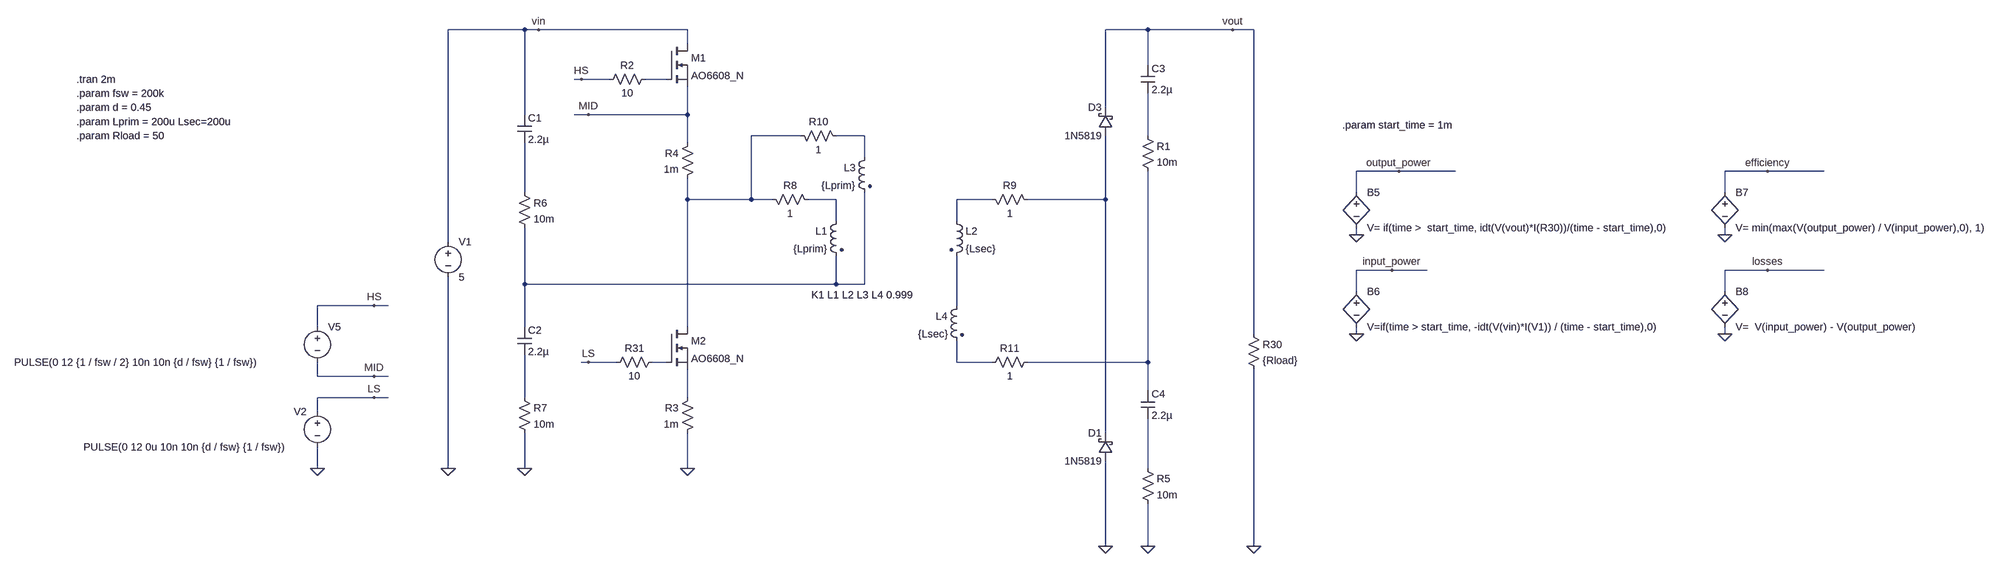
[diagram p0: schematic isolated_supply_v1.asc]
isolated_supply_v1.asc, the LTspice schematic file:
Version 4
SHEET 1 11460 3748
WIRE 656 272 480 272
WIRE 688 272 656 272
WIRE 1024 272 688 272
WIRE 2064 272 1968 272
WIRE 2320 272 2064 272
WIRE 2368 272 2320 272
WIRE 1024 304 1024 272
WIRE 2064 352 2064 272
WIRE 784 384 768 384
WIRE 848 384 784 384
WIRE 976 384 928 384
WIRE 1968 448 1968 272
WIRE 656 464 656 272
WIRE 800 464 768 464
WIRE 1024 464 1024 400
WIRE 1024 464 800 464
WIRE 1280 512 1168 512
WIRE 1424 512 1360 512
WIRE 2064 512 2064 416
WIRE 1024 528 1024 464
WIRE 1424 560 1424 512
WIRE 2736 592 2640 592
WIRE 2864 592 2736 592
WIRE 3680 592 3584 592
WIRE 3808 592 3680 592
WIRE 656 640 656 528
WIRE 2640 640 2640 592
WIRE 3584 640 3584 592
WIRE 1024 656 1024 608
WIRE 1168 656 1168 512
WIRE 1168 656 1024 656
WIRE 1216 656 1168 656
WIRE 1360 656 1296 656
WIRE 1712 656 1632 656
WIRE 1968 656 1968 512
WIRE 1968 656 1792 656
WIRE 1360 704 1360 656
WIRE 1632 704 1632 656
WIRE 2640 736 2640 720
WIRE 3584 736 3584 720
WIRE 480 752 480 272
WIRE 2720 816 2640 816
WIRE 2800 816 2720 816
WIRE 3680 816 3584 816
WIRE 3808 816 3680 816
WIRE 656 848 656 720
WIRE 1360 848 1360 784
WIRE 1360 848 656 848
WIRE 1424 848 1424 640
WIRE 1424 848 1360 848
WIRE 2640 864 2640 816
WIRE 3584 864 3584 816
WIRE 256 896 128 896
WIRE 288 896 256 896
WIRE 1632 896 1632 784
WIRE 128 944 128 896
WIRE 656 944 656 848
WIRE 1024 944 1024 656
WIRE 2368 960 2368 272
WIRE 2640 960 2640 944
WIRE 3584 960 3584 944
WIRE 800 1024 784 1024
WIRE 864 1024 800 1024
WIRE 976 1024 944 1024
WIRE 1632 1024 1632 976
WIRE 1712 1024 1632 1024
WIRE 2064 1024 2064 592
WIRE 2064 1024 1792 1024
WIRE 128 1056 128 1024
WIRE 256 1056 128 1056
WIRE 288 1056 256 1056
WIRE 2064 1088 2064 1024
WIRE 256 1104 128 1104
WIRE 288 1104 256 1104
WIRE 656 1104 656 1008
WIRE 1024 1104 1024 1040
WIRE 128 1136 128 1104
WIRE 1968 1184 1968 656
WIRE 128 1264 128 1216
WIRE 480 1264 480 832
WIRE 656 1264 656 1184
WIRE 1024 1264 1024 1184
WIRE 2064 1264 2064 1152
WIRE 1968 1440 1968 1248
WIRE 2064 1440 2064 1344
WIRE 2368 1440 2368 1040
FLAG 128 1264 0
FLAG 1968 1440 0
FLAG 1024 1264 0
FLAG 480 1264 0
FLAG 800 1024 LS
FLAG 256 1104 LS
FLAG 656 1264 0
FLAG 688 272 vin
FLAG 2320 272 vout
FLAG 2640 736 0
FLAG 2640 960 0
FLAG 2736 592 output_power
FLAG 2720 816 input_power
FLAG 3584 736 0
FLAG 3680 592 efficiency
FLAG 3584 960 0
FLAG 3680 816 losses
FLAG 800 464 MID
FLAG 784 384 HS
FLAG 256 1056 MID
FLAG 256 896 HS
FLAG 2064 1440 0
FLAG 2368 1440 0
SYMBOL res 2352 944 R0
SYMATTR InstName R30
SYMATTR Value {Rload}
SYMBOL res 960 1008 R90
WINDOW 0 0 56 VBottom 2
WINDOW 3 32 56 VTop 2
SYMATTR InstName R31
SYMATTR Value 10
SYMBOL voltage 480 736 R0
WINDOW 123 0 0 Left 0
WINDOW 39 0 0 Left 0
SYMATTR InstName V1
SYMATTR Value 5
SYMBOL cap 640 944 R0
SYMATTR InstName C2
SYMATTR Value 2.2µ
SYMBOL res 944 368 R90
WINDOW 0 0 56 VBottom 2
WINDOW 3 32 56 VTop 2
SYMATTR InstName R2
SYMATTR Value 10
SYMBOL voltage 128 1120 M0
WINDOW 123 0 0 Left 0
WINDOW 39 0 0 Left 0
WINDOW 3 72 96 Left 2
SYMATTR Value PULSE(0 12 0u 10n 10n {d / fsw} {1 / fsw})
SYMATTR InstName V2
SYMBOL res 1040 1088 M0
SYMATTR InstName R3
SYMATTR Value 1m
SYMBOL res 1040 512 M0
SYMATTR InstName R4
SYMATTR Value 1m
SYMBOL bv 2640 624 R0
SYMATTR InstName B5
SYMATTR Value V= if(time >  start_time, idt(V(vout)*I(R30))/(time - start_time),0)
SYMBOL bv 2640 848 R0
SYMATTR InstName B6
SYMATTR Value V=if(time > start_time, -idt(V(vin)*I(V1)) / (time - start_time),0)
SYMBOL bv 3584 624 R0
SYMATTR InstName B7
SYMATTR Value V= min(max(V(output_power) / V(input_power),0), 1)
SYMBOL bv 3584 848 R0
SYMATTR InstName B8
SYMATTR Value V=  V(input_power) - V(output_power)
SYMBOL res 2048 496 R0
SYMATTR InstName R1
SYMATTR Value 10m
SYMBOL res 2048 1248 R0
SYMATTR InstName R5
SYMATTR Value 10m
SYMBOL res 640 624 R0
SYMATTR InstName R6
SYMATTR Value 10m
SYMBOL res 640 1088 R0
SYMATTR InstName R7
SYMATTR Value 10m
SYMBOL voltage 128 928 R0
WINDOW 123 0 0 Left 0
WINDOW 39 0 0 Left 0
WINDOW 3 -685 96 Left 2
SYMATTR Value PULSE(0 12 {1 / fsw / 2} 10n 10n {d / fsw} {1 / fsw})
SYMATTR InstName V5
SYMBOL schottky 1984 512 R180
WINDOW 0 24 64 Left 2
WINDOW 3 24 0 Left 2
SYMATTR InstName D3
SYMATTR Value 1N5819
SYMATTR Description Diode
SYMATTR Type diode
SYMBOL cap 640 464 R0
SYMATTR InstName C1
SYMATTR Value 2.2µ
SYMBOL cap 2048 352 R0
SYMATTR InstName C3
SYMATTR Value 2.2µ
SYMBOL cap 2048 1088 R0
SYMATTR InstName C4
SYMATTR Value 2.2µ
SYMBOL schottky 1984 1248 R180
WINDOW 0 24 64 Left 2
WINDOW 3 24 0 Left 2
SYMATTR InstName D1
SYMATTR Value 1N5819
SYMATTR Description Diode
SYMATTR Type diode
SYMBOL nmos 976 304 R0
SYMATTR InstName M1
SYMATTR Value AO6608_N
SYMBOL ind2 1376 688 M0
SYMATTR InstName L1
SYMATTR Value {Lprim}
SYMATTR Type ind
SYMBOL ind2 1616 688 R0
SYMATTR InstName L2
SYMATTR Value {Lsec}
SYMATTR Type ind
SYMBOL res 1312 672 M270
WINDOW 0 32 56 VTop 2
WINDOW 3 0 56 VBottom 2
SYMATTR InstName R8
SYMATTR Value 1
SYMBOL res 1808 672 M270
WINDOW 0 32 56 VTop 2
WINDOW 3 0 56 VBottom 2
SYMATTR InstName R9
SYMATTR Value 1
SYMBOL ind2 1440 544 M0
SYMATTR InstName L3
SYMATTR Value {Lprim}
SYMATTR Type ind
SYMBOL res 1376 528 M270
WINDOW 0 32 56 VTop 2
WINDOW 3 0 56 VBottom 2
SYMATTR InstName R10
SYMATTR Value 1
SYMBOL ind2 1648 880 M0
SYMATTR InstName L4
SYMATTR Value {Lsec}
SYMATTR Type ind
SYMBOL res 1808 1008 R90
WINDOW 0 0 56 VBottom 2
WINDOW 3 32 56 VTop 2
SYMATTR InstName R11
SYMATTR Value 1
SYMBOL nmos 976 944 R0
SYMATTR InstName M2
SYMATTR Value AO6608_N
TEXT -416 384 Left 2 !.tran 2m
TEXT -416 416 Left 2 !.param fsw = 200k
TEXT -416 448 Left 2 !.param d = 0.45
TEXT 2608 488 Left 2 !.param start_time = 1m
TEXT -416 512 Left 2 !.param Rload = 50
TEXT 1304 872 Left 2 !K1 L1 L2 L3 L4 0.999
TEXT -416 480 Left 2 !.param Lprim = 200u Lsec=200u

The netlist it stands for:
* isolated_supply_v1.asc
R30 vout 0 {Rload}
R31 N011 LS 10
V1 vin 0 5
C2 N009 N014 2.2µ
R2 N001 HS 10
V2 LS 0 PULSE(0 12 0u 10n 10n {d / fsw} {1 / fsw})
R3 N015 0 1m
R4 MID N002 1m
B5 output_power 0 V= if(time >  start_time, idt(V(vout)*I(R30))/(time - start_time),0)
B6 input_power 0 V=if(time > start_time, -idt(V(vin)*I(V1)) / (time - start_time),0)
B7 efficiency 0 V= min(max(V(output_power) / V(input_power),0), 1)
B8 losses 0 V=  V(input_power) - V(output_power)
R1 N004 N013 10m
R5 N016 0 10m
R6 N005 N009 10m
R7 N014 0 10m
V5 HS MID PULSE(0 12 {1 / fsw / 2} 10n 10n {d / fsw} {1 / fsw})
D3 N008 vout 1N5819
C1 vin N005 2.2µ
C3 vout N004 2.2µ
C4 N013 N016 2.2µ
D1 0 N008 1N5819
M1 vin N001 MID MID AO6608_N
L1 N006 N009 {Lprim}
L2 N007 N010 {Lsec}
R8 N006 N002 1
R9 N008 N007 1
L3 N003 N009 {Lprim}
R10 N003 N002 1
L4 N010 N012 {Lsec}
R11 N013 N012 1
M2 N002 N011 N015 N015 AO6608_N
.model D D
.lib standard.dio
.model NMOS NMOS
.model PMOS PMOS
.lib standard.mos
.tran 2m
.param fsw = 200k
.param d = 0.45
.param start_time = 1m
.param Rload = 50
K1 L1 L2 L3 L4 0.999
.param Lprim = 200u Lsec=200u
.backanno
.end